# EAGLE design fatshark58 (EAGLE 6.4)
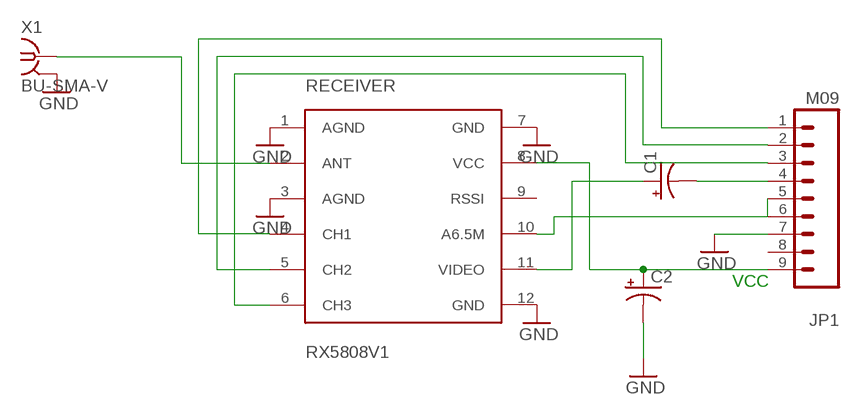
[diagram p0: schematic, sheet 1]

## Parts
C1  CAP_POL7343  [EIA7343]
C2  CAP_POL7343  [EIA7343]
JP1  M09  [1X09]
RECEIVER  RX5808V1  [RX5808]
X1  BU-SMA-V  [BU-SMA-V]

## Nets
GND: C2.C(-) JP1.7 RECEIVER.1(AGND) RECEIVER.3(AGND) RECEIVER.7(GND) RECEIVER.12(GND) X1.2 X1.3 X1.4 X1.5
N$1: JP1.3 RECEIVER.6(CH3)
N$4: C1.A(+) RECEIVER.11(VIDEO)
N$5: JP1.1 RECEIVER.4(CH1)
N$6: JP1.2 RECEIVER.5(CH2)
N$7: C2.A(+) JP1.9 RECEIVER.8(VCC)
N$8: JP1.5 JP1.6 RECEIVER.10(A6.5M)
N$9: C1.C(-) JP1.4
N$10: RECEIVER.2(ANT) X1.1
Unconnected: JP1.8 RECEIVER.9(RSSI)

## Notes on the sheet
- VCC

## Library data of the parts
C1 C2 = SparkFun-Capacitors:CAP_POL: Capacitor Polarized These are standard SMD and PTH capacitors. Normally 10uF, 47uF, and 100uF in electrolytic and tantalum varieties. Always verify the external diameter of the through hole cap, it varies with capacity, voltage, and manufacturer. The EIA devices should be standard.
JP1 = SparkFun-Connectors:M09: Header 9 Standard 9-pin 0.1" header. Use with straight break away headers (SKU : PRT-00116), right angle break away headers (PRT-00553), swiss pins (PRT-00743), machine pins (PRT-00117), and female headers (PRT-00115).
RECEIVER = receiver:RX5808
X1 = con-coax:BU-SMA-V: FEMALE SMA CONNECTOR Radiall distributor RS 112-3794; OC_FARNELL: unknown; OC_NEWARK: unknown

## Net classes
0 default: width 0.305 mm, drill 0.508 mm, clearance 0.254 mm

## Board
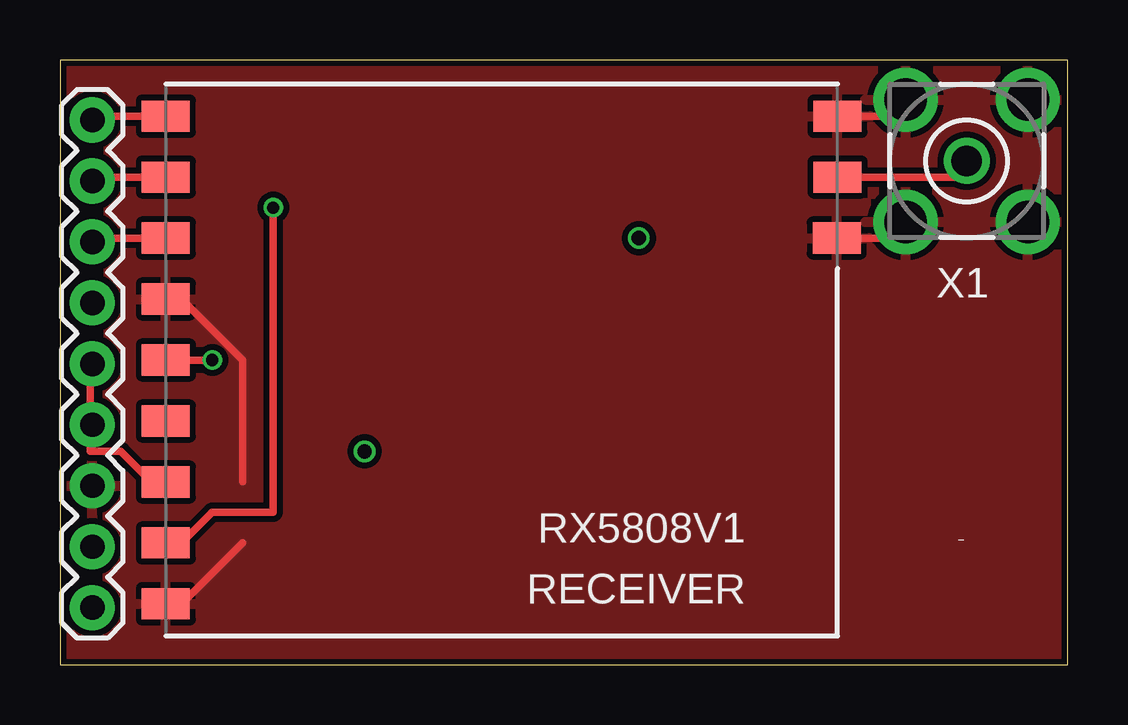
[diagram p1: board, top side]
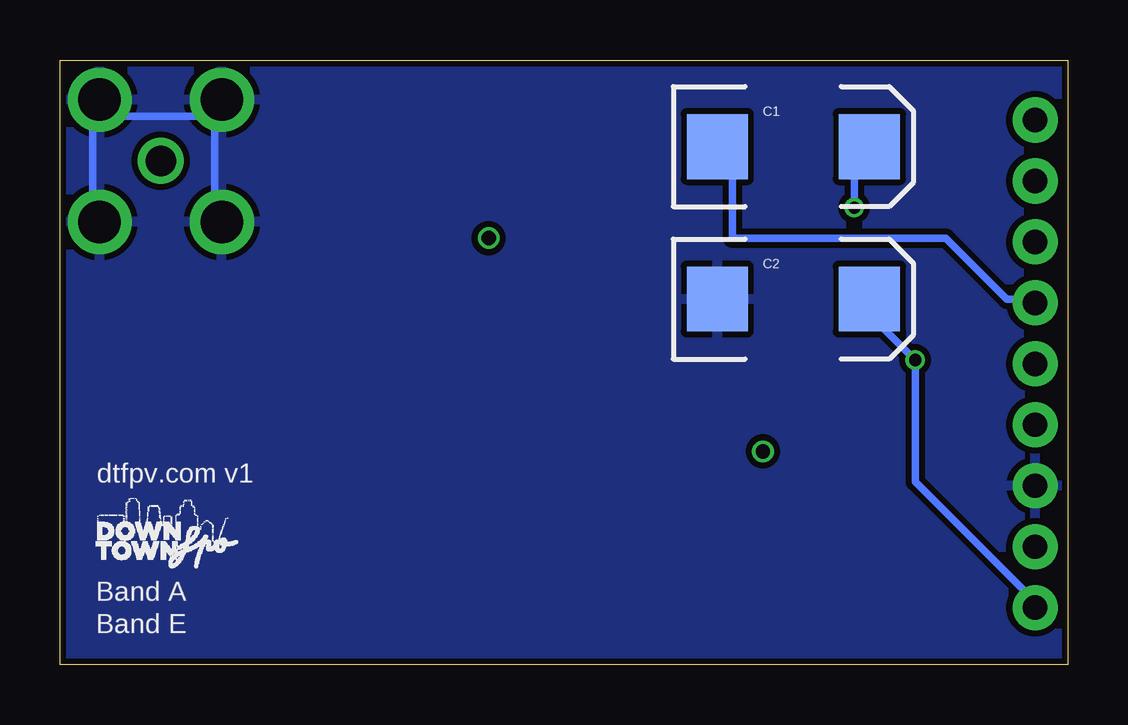
[diagram p2: board, bottom side, seen from below]

Size 42 x 25.2 mm. Coordinates in mm from the lower left corner, seen from the top.
Outline: 0,0 42,0 42,25.2 0,25.2 0,0
Copper layers (1*16): Top 0.035mm / dielectric 1.5mm / Bottom 0.035mm
Design rules "SeeedStudio_DRU_no_angle_2layer *": minimum track width 6mil, minimum drill 12mil, track to track 6mil, track to pad 8mil, pad to pad 6mil, via to via 6mil, smd to smd 0mil, copper to edge 10mil, drill to drill 10mil, minimum pad ring 10mil, minimum via ring 6mil, stop-mask expansion 2mil, vias tented up to drill 25mil, thermal gap 10mil

### Footprints (pad centres in the part's own frame; a part is rotated, then mirrored left to right if it is on the bottom)
EIA7343 = smd 2.55 x 2.7: A 3.17,0; C -3.17,0
1X09 = drill 1.016 pad 1.88: 1 0,0; 2 2.54,0; 3 5.08,0; 4 7.62,0; 5 10.16,0; 6 12.7,0; 7 15.24,0; 8 17.78,0; 9 20.32,0
RX5808 = smd 2 x 1.3: 1 -13.97,-5.08; 2 -14,-7.62; 3 -14,-10.16; 4 14,-10.16; 5 14,-7.62; 6 14,-5.08; 7 14,-2.54; 8 14,0; 9 14,2.54; 10 14,5.08; 11 14,7.62; 12 14,10.16
BU-SMA-V = drill 1.27: 1 0,0 | drill 1.778: 2 -2.55,2.55; 3 2.55,2.55; 4 2.55,-2.55; 5 -2.55,-2.55

### Placement (x,y rotation side)
C1  11.43,21.59 0 bottom
C2  11.43,15.24 0 bottom
JP1  1.35,22.7 270 top
RECEIVER  18.41,12.7 180 top
X1  37.8,21 0 top

### Tracks (layer width: path | path; a pad name or v marks a point on that pad's centre or on a via)
GND
  Top 0.305: RECEIVER.1 34.29,17.78 X1.5 | RECEIVER.3 34.29,22.86 X1.2 | 7.62,5.08 5.08,2.54 RECEIVER.12 | 7.62,7.62 7.62,12.7 5.08,15.24 RECEIVER.7
  Bottom 0.305: X1.4 40.64,19.05 40.64,22.86 X1.3 39.37,22.86 35.56,22.86 | 35.56,22.86 35.56,19.05 X1.5 | 35.56,22.86 X1.2 | 1.27,7.62 JP1.7
  pour Top: 0,25.2 0,0 42,0 42,25.2
  pour Bottom: 0,25.4 0,0 41.91,0 41.91,25.4
N$1
  Top 0.305: RECEIVER.6 1.27,17.78 JP1.3
N$2  (via drill 0.6)
  other vias: 12.7,8.89
N$3  (via drill 0.6)
  other vias: 24.13,17.78
N$4  (via drill 0.51)
  Top 0.305: v8.89,19.05 8.89,6.35 6.35,6.35 5.08,5.08 RECEIVER.11
  Bottom 0.305: v8.89,19.05 8.89,21.59 C1.A
N$5
  Top 0.305: RECEIVER.4 1.27,22.86 JP1.1
N$6
  Top 0.305: RECEIVER.5 1.27,20.32 JP1.2
N$7  (via drill 0.51)
  Top 0.305: v6.35,12.7 RECEIVER.8
  Bottom 0.305: C2.A 8.89,15.24 v6.35,12.7 6.35,7.62 1.27,2.54 JP1.9
N$8
  Top 0.305: 1.27,10.16 1.27,8.89 2.54,8.89 3.81,7.62 RECEIVER.10 | 1.27,10.16 1.27,12.7 JP1.5 | 1.27,10.16 JP1.6
N$9
  Bottom 0.305: C1.C 13.97,21.59 13.97,17.78 5.08,17.78 2.54,15.24 1.27,15.24 JP1.4
N$10
  Top 0.305: RECEIVER.2 38.1,20.32 X1.1

### Text on the board
tPlace: Band A
bPlace: Band A | Band E
bNames: dtfpv.com v1